# EasyEDA schematic seedrum_relay_v1.json
TITLE: Seedup Relay; REV: 1.0; Date: 2020-10-29; Sheet: 1/1; Drawn By: Victor Halla; Company: Seedup
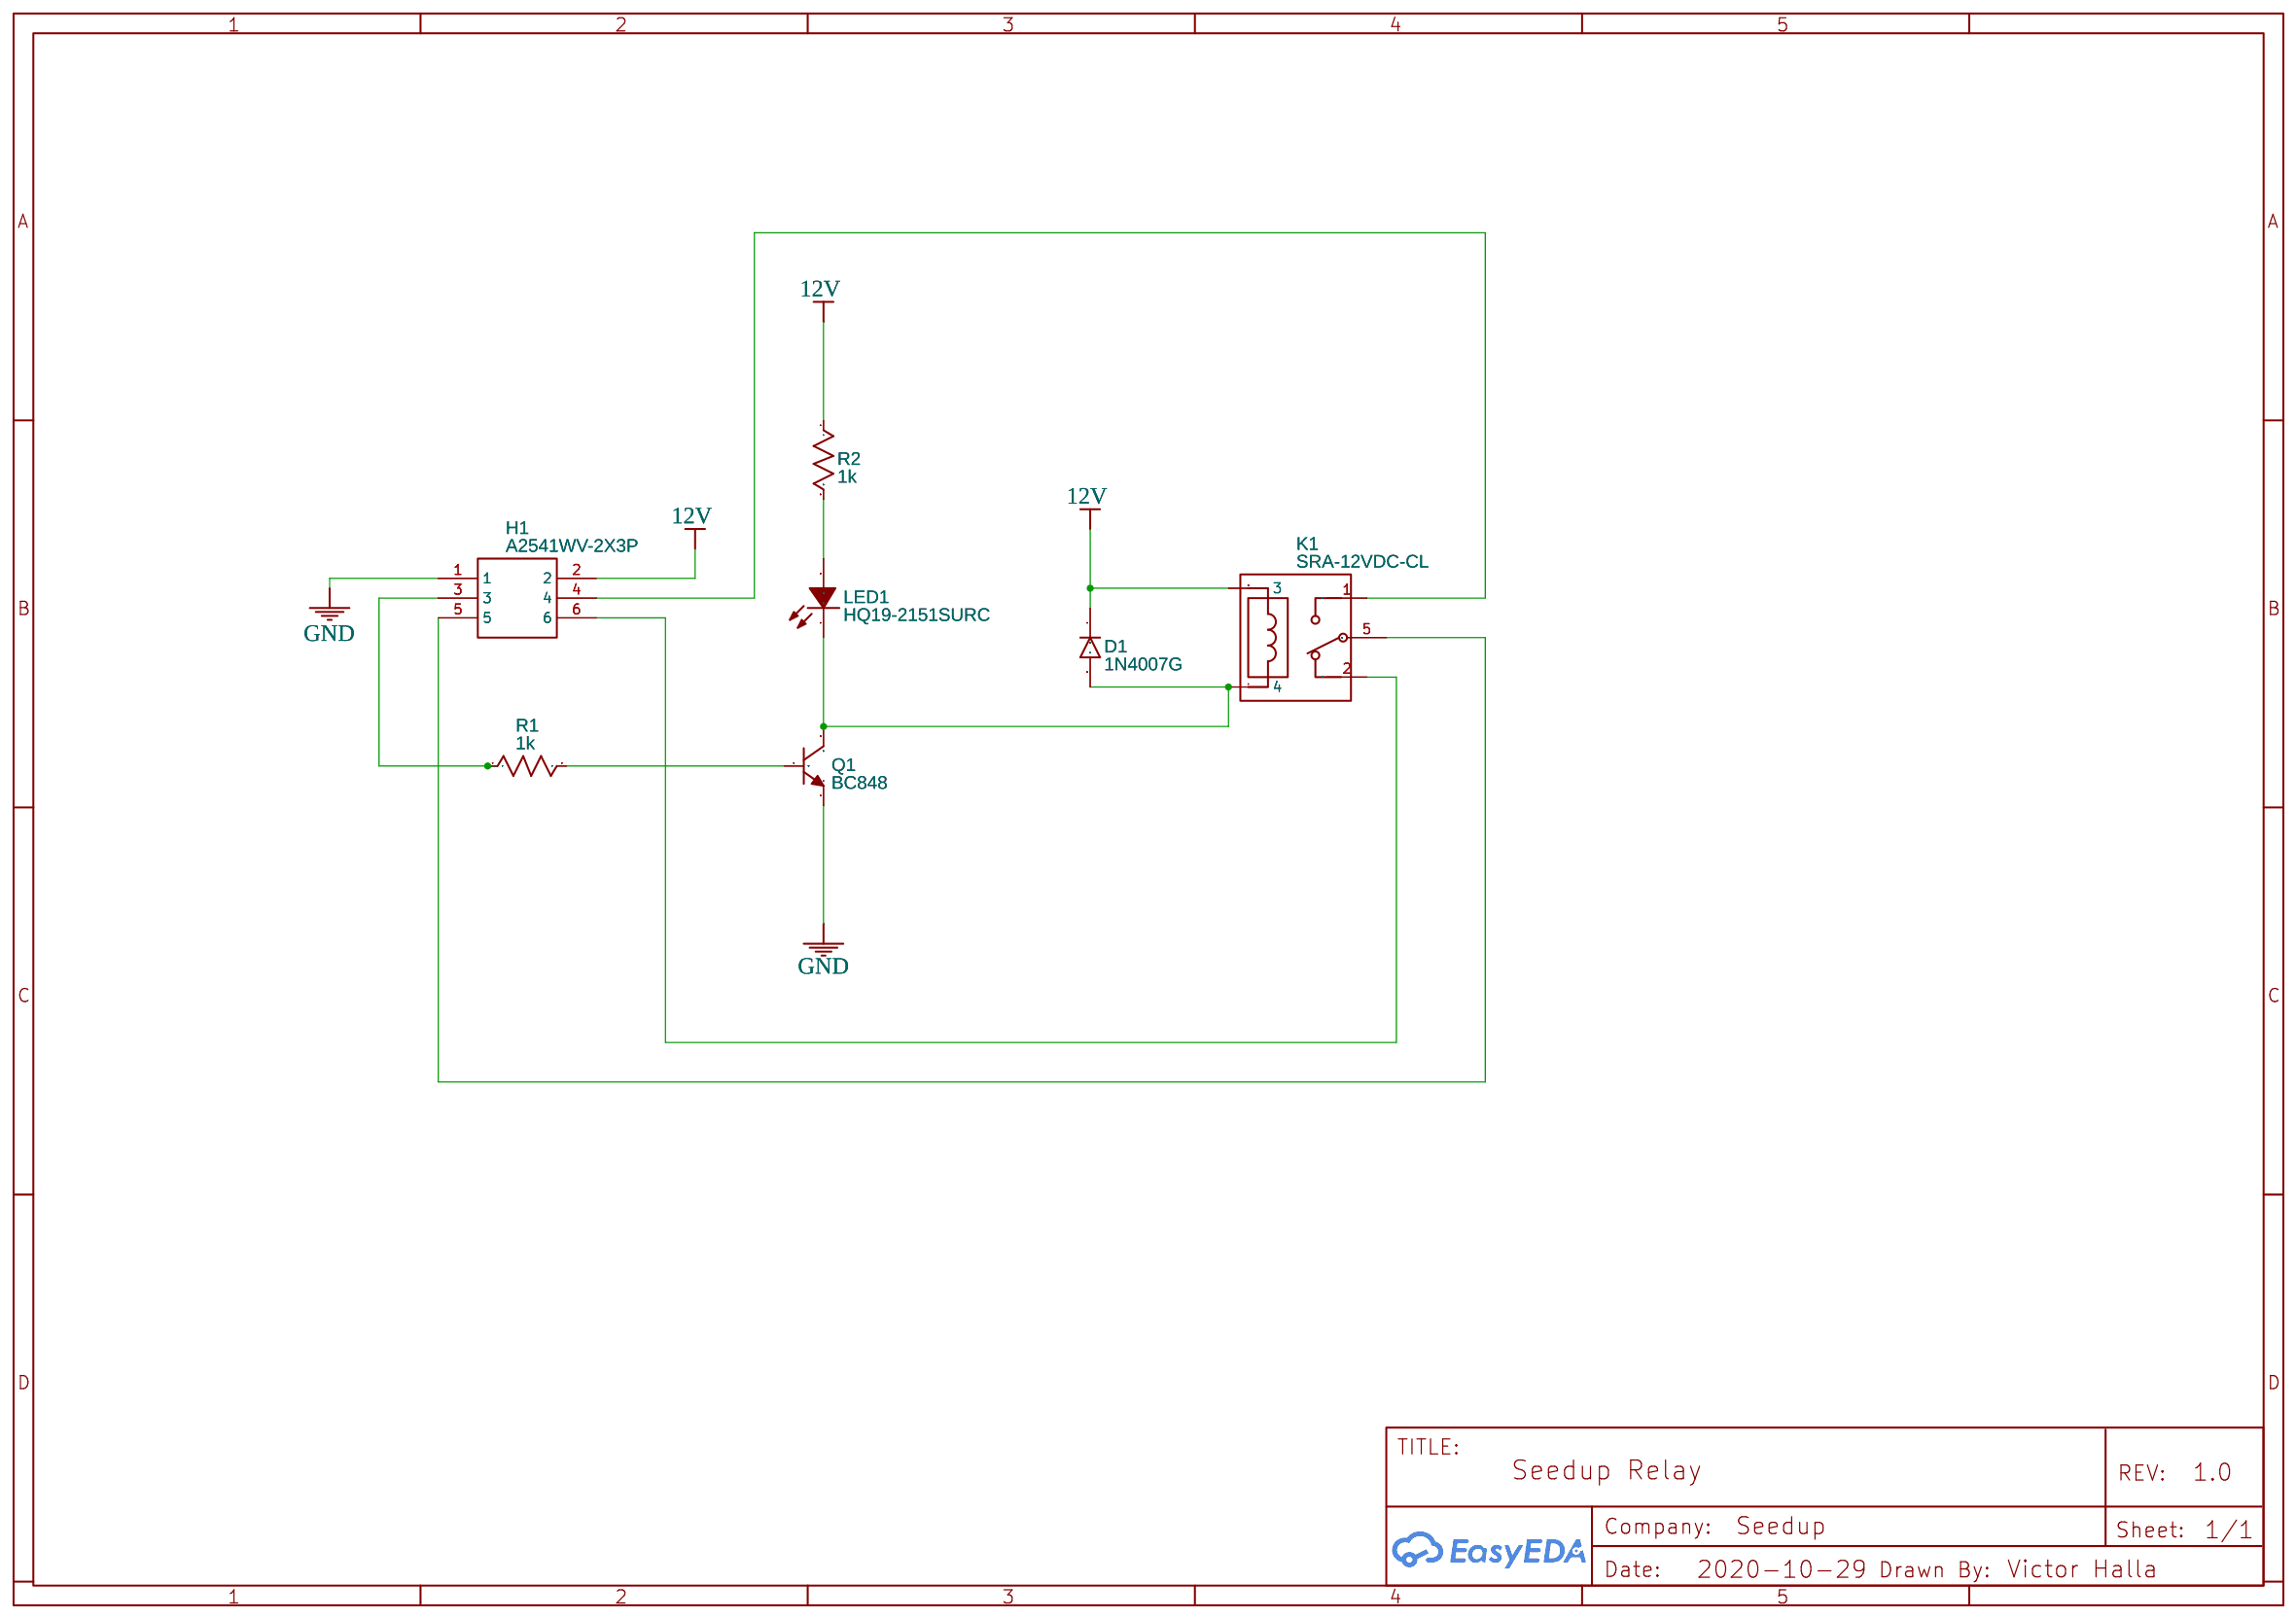
[diagram p0: schematic sheet]

## Parts
D1  1N4007G  [SMA_L4.4-W2.6-LS5.0-RD]
H1  A2541WV-2X3P  [HDR-TH_6P-P2.54-V-R2-C3-S2.54_A2541WV-2X3P]
K1  SRA-12VDC-CL  [RELAY-TH_SRA-X-CX]
LED1  HQ19-2151SURC  [LED0603-RD]
Q1  BC848  [SOT-23-3_L2.9-W1.3-P1.90-LS2.4-BR]
R1  1k  [R0603]
R2  1k  [R0603]

## Library data of the parts
D1 = 1N4007G: Supplier: LCSC; Manufacturer: SK; Contributor: LCSC; Supplier Part: C111122
H1 = A2541WV-2X3P: Supplier: LCSC; Supplier Part: C225518; Manufacturer: Changjiang Connectors; Manufacturer Part: A2541WV-2x3P; Contributor: LCSC
K1 = SRA-12VDC-CL: Supplier: LCSC; Manufacturer: SONGLE; image: //image.lceda.cn/szlcsc/C60169.jpg; Supplier Part: C60169
LED1 = HQ19-2151SURC: Supplier: LCSC; Supplier Part: C258842; Manufacturer: Harvatek Optoelectronics (Shenzhen); Contributor: LCSC
Q1 = BC848: Supplier: LCSC; Supplier Part: C692844; Manufacturer: HT(Shenzhen Jinyu Semicon); Contributor: LCSC
R1 R2 = R_0603_US: Contributor: LCEDA_Lib

## Nets
12V: D1.1(C) H1.2 K1.3 R2.1
GND: H1.1 Q1.2(E)
Net-(D1-2): D1.2(A) K1.4 LED1.1(K) Q1.3(C)
Net-(H1-3): H1.3 R1.1
Net-(H1-4): H1.4 K1.1
Net-(H1-5): H1.5 K1.5
Net-(H1-6): H1.6 K1.2
Net-(LED1-2): LED1.2(A) R2.2
Net-(Q1-1): Q1.1(B) R1.2
